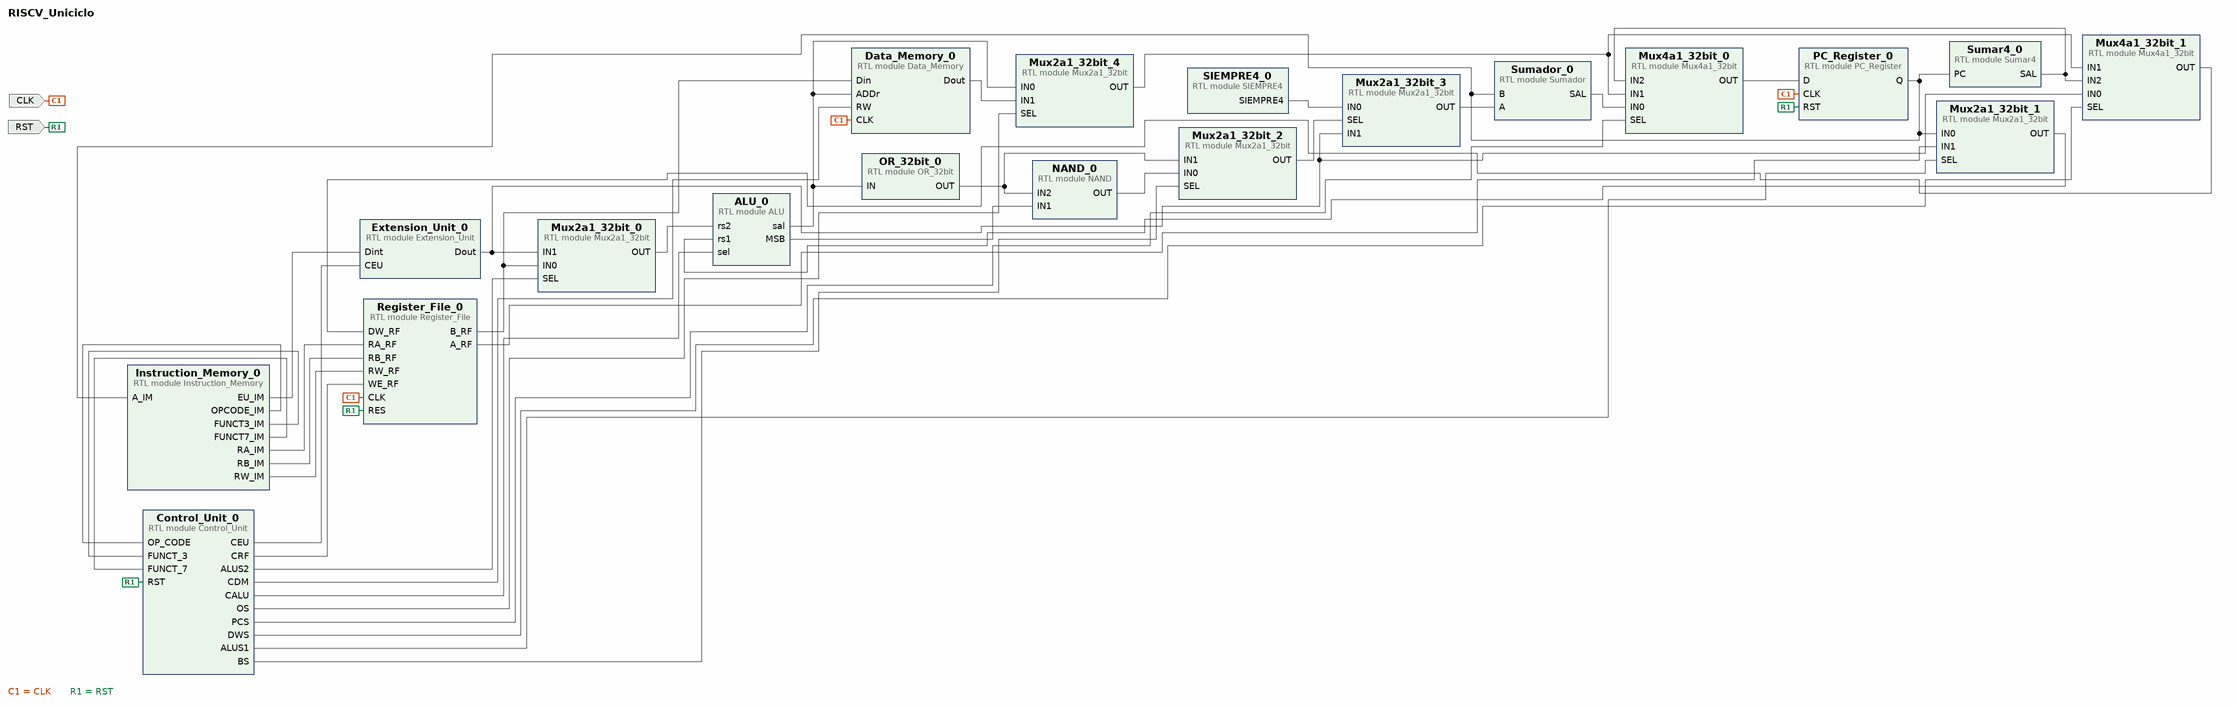
[diagram p0: block diagram of the top level]
# Vivado block design RISCV_Uniciclo, xcvc1802-viva1596-1LHP-i-L, Vivado 2020.3
create_bd_design RISCV_Uniciclo

create_bd_port -dir I CLK
create_bd_port -dir I RST

create_bd_cell -type module -reference Instruction_Memory Instruction_Memory_0
create_bd_cell -type module -reference Sumar4 Sumar4_0
create_bd_cell -type module -reference Sumador Sumador_0
create_bd_cell -type module -reference Extension_Unit Extension_Unit_0
create_bd_cell -type module -reference OR_32bit OR_32bit_0
create_bd_cell -type module -reference Mux4a1_32bit Mux4a1_32bit_0
create_bd_cell -type module -reference Mux4a1_32bit Mux4a1_32bit_1
create_bd_cell -type module -reference PC_Register PC_Register_0
create_bd_cell -type module -reference Register_File Register_File_0
create_bd_cell -type module -reference Mux2a1_32bit Mux2a1_32bit_0
create_bd_cell -type module -reference Mux2a1_32bit Mux2a1_32bit_1
create_bd_cell -type module -reference Mux2a1_32bit Mux2a1_32bit_2
create_bd_cell -type module -reference Mux2a1_32bit Mux2a1_32bit_3
create_bd_cell -type module -reference Mux2a1_32bit Mux2a1_32bit_4
create_bd_cell -type module -reference SIEMPRE4 SIEMPRE4_0
create_bd_cell -type module -reference Control_Unit Control_Unit_0
create_bd_cell -type module -reference NAND NAND_0
create_bd_cell -type module -reference Data_Memory Data_Memory_0
create_bd_cell -type module -reference ALU ALU_0

# ---- connections ----

connect_bd_net [get_bd_pins Mux4a1_32bit_0/OUT] [get_bd_pins PC_Register_0/D]
connect_bd_net [get_bd_pins PC_Register_0/Q] \
  [get_bd_pins Instruction_Memory_0/A_IM] [get_bd_pins Sumar4_0/PC] [get_bd_pins Sumador_0/B] \
  [get_bd_pins Mux2a1_32bit_1/IN0]
connect_bd_net [get_bd_pins Sumar4_0/SAL] [get_bd_pins Mux4a1_32bit_0/IN2] [get_bd_pins Mux4a1_32bit_1/IN2]
connect_bd_net [get_bd_pins Instruction_Memory_0/RA_IM] [get_bd_pins Register_File_0/RA_RF]
connect_bd_net [get_bd_pins Instruction_Memory_0/RB_IM] [get_bd_pins Register_File_0/RB_RF]
connect_bd_net [get_bd_pins Instruction_Memory_0/RW_IM] [get_bd_pins Register_File_0/RW_RF]
connect_bd_net [get_bd_pins Mux2a1_32bit_4/OUT] [get_bd_pins Mux4a1_32bit_0/IN1] [get_bd_pins Mux4a1_32bit_1/IN1]
connect_bd_net [get_bd_pins Mux4a1_32bit_1/OUT] [get_bd_pins Register_File_0/DW_RF]
connect_bd_net [get_bd_pins Sumador_0/SAL] [get_bd_pins Mux4a1_32bit_0/IN0]
connect_bd_net [get_bd_pins Instruction_Memory_0/EU_IM] [get_bd_pins Extension_Unit_0/Dint]
connect_bd_net [get_bd_pins Extension_Unit_0/Dout] [get_bd_pins Mux4a1_32bit_1/IN0] [get_bd_pins Mux2a1_32bit_0/IN1] [get_bd_pins Mux2a1_32bit_3/IN1]
connect_bd_net [get_bd_pins Register_File_0/A_RF] [get_bd_pins Mux2a1_32bit_1/IN1]
connect_bd_net [get_bd_pins Register_File_0/B_RF] [get_bd_pins Mux2a1_32bit_0/IN0] [get_bd_pins Data_Memory_0/Din]
connect_bd_net [get_bd_pins Mux2a1_32bit_0/OUT] [get_bd_pins ALU_0/rs2]
connect_bd_net [get_bd_pins Mux2a1_32bit_1/OUT] [get_bd_pins ALU_0/rs1]
connect_bd_net [get_bd_pins ALU_0/sal] [get_bd_pins OR_32bit_0/IN] [get_bd_pins Mux2a1_32bit_4/IN0] [get_bd_pins Data_Memory_0/ADDr]
connect_bd_net [get_bd_pins OR_32bit_0/OUT] [get_bd_pins Mux2a1_32bit_2/IN1] [get_bd_pins NAND_0/IN2]
connect_bd_net [get_bd_pins NAND_0/OUT] [get_bd_pins Mux2a1_32bit_2/IN0]
connect_bd_net [get_bd_pins Mux2a1_32bit_2/OUT] [get_bd_pins Mux2a1_32bit_3/SEL]
connect_bd_net [get_bd_pins Mux2a1_32bit_3/OUT] [get_bd_pins Sumador_0/A]
connect_bd_net [get_bd_ports CLK] [get_bd_pins PC_Register_0/CLK] [get_bd_pins Register_File_0/CLK] [get_bd_pins Data_Memory_0/CLK]
connect_bd_net [get_bd_pins Data_Memory_0/Dout] [get_bd_pins Mux2a1_32bit_4/IN1]
connect_bd_net [get_bd_pins Instruction_Memory_0/OPCODE_IM] [get_bd_pins Control_Unit_0/OP_CODE]
connect_bd_net [get_bd_pins Instruction_Memory_0/FUNCT3_IM] [get_bd_pins Control_Unit_0/FUNCT_3]
connect_bd_net [get_bd_pins Instruction_Memory_0/FUNCT7_IM] [get_bd_pins Control_Unit_0/FUNCT_7]
connect_bd_net [get_bd_pins Control_Unit_0/CRF] [get_bd_pins Register_File_0/WE_RF]
connect_bd_net [get_bd_pins Control_Unit_0/CEU] [get_bd_pins Extension_Unit_0/CEU]
connect_bd_net [get_bd_pins Control_Unit_0/CALU] [get_bd_pins ALU_0/sel]
connect_bd_net [get_bd_pins Control_Unit_0/CDM] [get_bd_pins Data_Memory_0/RW]
connect_bd_net [get_bd_pins Control_Unit_0/PCS] [get_bd_pins Mux4a1_32bit_0/SEL]
connect_bd_net [get_bd_pins Control_Unit_0/DWS] [get_bd_pins Mux4a1_32bit_1/SEL]
connect_bd_net [get_bd_pins Control_Unit_0/ALUS1] [get_bd_pins Mux2a1_32bit_1/SEL]
connect_bd_net [get_bd_pins Control_Unit_0/ALUS2] [get_bd_pins Mux2a1_32bit_0/SEL]
connect_bd_net [get_bd_pins Control_Unit_0/OS] [get_bd_pins Mux2a1_32bit_4/SEL]
connect_bd_net [get_bd_pins Control_Unit_0/BS] [get_bd_pins Mux2a1_32bit_2/SEL]
connect_bd_net [get_bd_ports RST] [get_bd_pins PC_Register_0/RST] [get_bd_pins Register_File_0/RES] [get_bd_pins Control_Unit_0/RST]
connect_bd_net [get_bd_pins ALU_0/MSB] [get_bd_pins NAND_0/IN1]
connect_bd_net [get_bd_pins SIEMPRE4_0/SIEMPRE4] [get_bd_pins Mux2a1_32bit_3/IN0]

validate_bd_design
save_bd_design
